# Altium schematic sheet 最小系统原理图.SchDoc
size A4
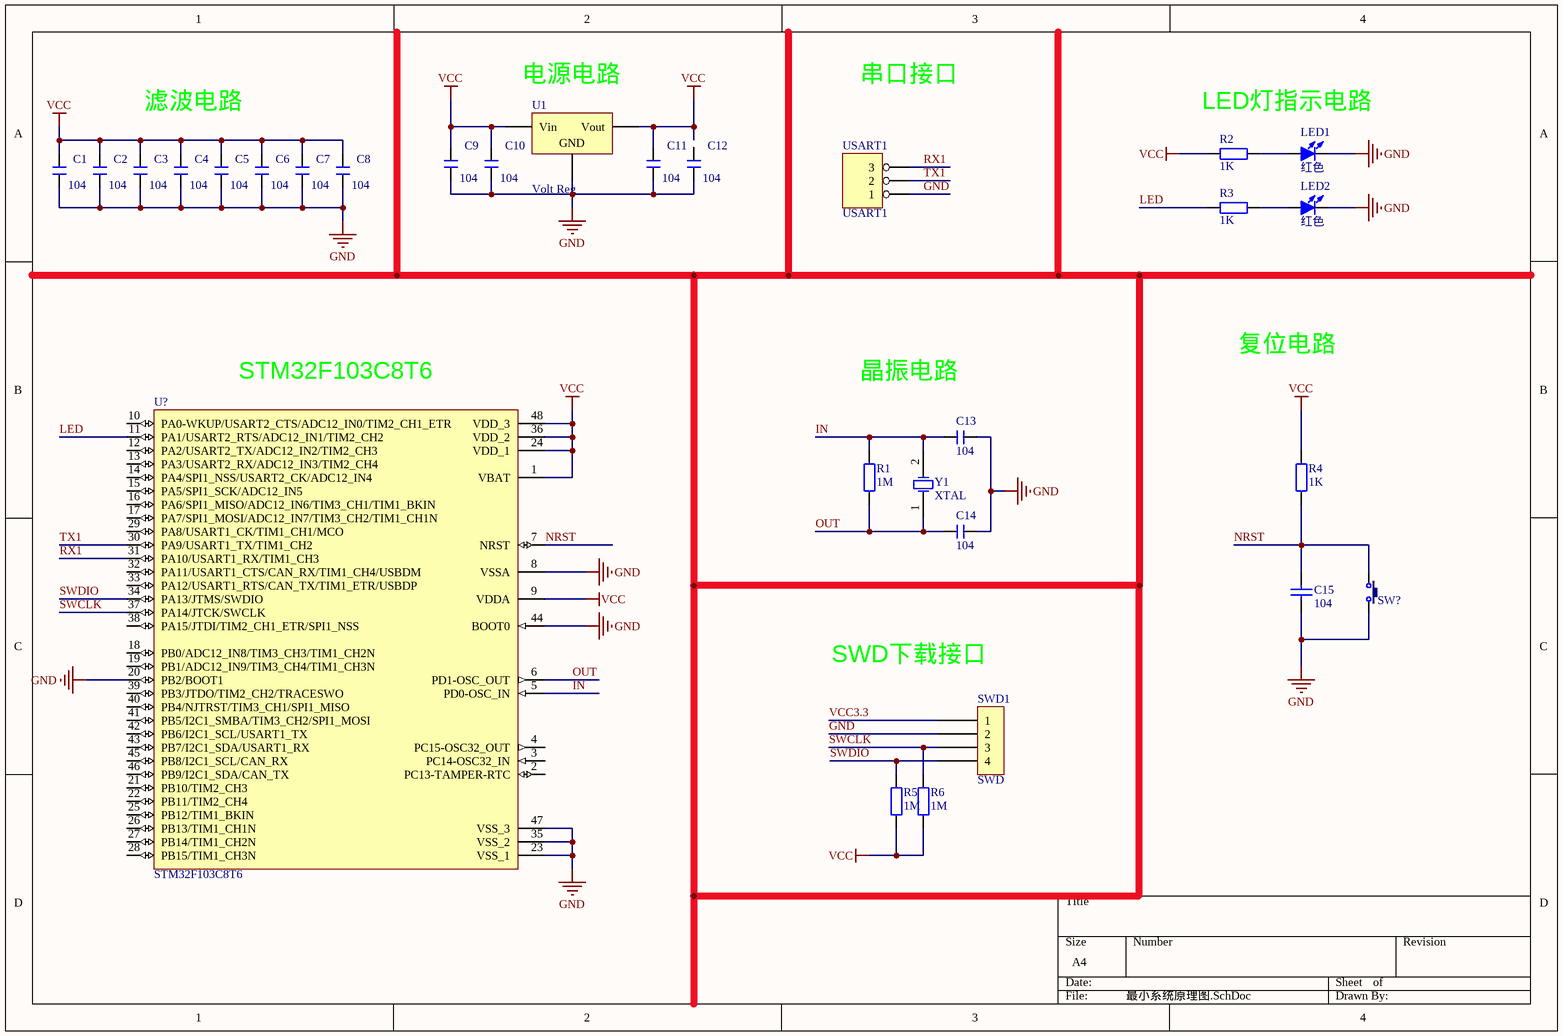
[diagram p0: 最小系统原理图.SchDoc]

## Parts
C1  104  [C 0805_L]
C2  104  [C 0805_L]
C3  104  [C 0805_L]
C4  104  [C 0805_L]
C5  104  [C 0805_L]
C6  104  [C 0805_L]
C7  104  [C 0805_L]
C8  104  [C 0805_L]
C9  104  [C 0805_L]
C10  104  [C 0805_L]
C11  104  [C 0805_L]
C12  104  [C 0805_L]
C13  104  [C 0805_L]
C14  104  [C 0805_L]
C15  104  [0805_c]
LED1  红色  [LED F234-W]
LED2  红色  [LED F234-W]
R1  1M  [RS 1/4W]
R2  1K  [RS 1/4W]
R3  1K  [RS 1/4W]
R4  1K  [RS 1/4W]
R5  1M  [RS 1/4W]
R6  1M  [RS 1/4W]
SW?  6x6x5  [TSW DIP-6*6*6_V]  (value not drawn)
SWD1  SWD
U1  Volt Reg  [D2PAK_N]
U?  STM32F103C8T6  [LQFP48_N]
USART1  USART1  [header3]
Y1  XTAL  [R38]

## Nets
GND: C1.1 C2.1 C3.1 C4.1 C5.1 C6.1 C7.1 C8.1 C9.1 C10.1 C11.1 C12.1 C13.1 C14.1 C15.1 LED1.2(K) LED2.2(K) SW?.2 SWD1.2 U1.2(GND) U?.8(VSSA) U?.20(PB2/BOOT1) U?.23(VSS_1) U?.35(VSS_2) U?.44(BOOT0) U?.47(VSS_3) USART1.1
VCC: C1.2 C2.2 C3.2 C4.2 C5.2 C6.2 C7.2 C8.2 C9.2 C10.2 C11.2 R2.1 R4.2 R5.1 R6.1 U1.1(Vin) U1.3(Vout) U?.1(VBAT) U?.9(VDDA) U?.24(VDD_1) U?.36(VDD_2) U?.48(VDD_3)
IN: C13.2 R1.2 U?.5(PD0-OSC_IN) Y1.2(OSC2)
LED: R3.1 U?.11(PA1/USART2_RTS/ADC12_IN1/TIM2_CH2)
NRST: C15.2 R4.1 SW?.1 U?.7(NRST)
OUT: C14.2 R1.1 U?.6(PD1-OSC_OUT) Y1.1(OSC1)
RX1: U?.31(PA10/USART1_RX/TIM1_CH3) USART1.3
SWCLK: R6.2 SWD1.3 U?.37(PA14/JTCK/SWCLK)
SWDIO: R5.2 SWD1.4 U?.34(PA13/JTMS/SWDIO)
TX1: U?.30(PA9/USART1_TX/TIM1_CH2) USART1.2
VCC3.3: SWD1.1
NetLED1_1: LED1.1(A) R2.2
NetLED2_1: LED2.1(A) R3.2

Not connected (* = marked no-connect by the designer): C12 2; U? 2(PC13-TAMPER-RTC) 3(PC14-OSC32_IN) 4(PC15-OSC32_OUT) 10(PA0-WKUP/USART2_CTS/ADC12_IN0/TIM2_CH1_ETR) 12(PA2/USART2_TX/ADC12_IN2/TIM2_CH3) 13(PA3/USART2_RX/ADC12_IN3/TIM2_CH4) 14(PA4/SPI1_NSS/USART2_CK/ADC12_IN4) 15(PA5/SPI1_SCK/ADC12_IN5) 16(PA6/SPI1_MISO/ADC12_IN6/TIM3_CH1/TIM1_BKIN) 17(PA7/SPI1_MOSI/ADC12_IN7/TIM3_CH2/TIM1_CH1N) 18(PB0/ADC12_IN8/TIM3_CH3/TIM1_CH2N) 19(PB1/ADC12_IN9/TIM3_CH4/TIM1_CH3N) 21(PB10/TIM2_CH3) 22(PB11/TIM2_CH4) 25(PB12/TIM1_BKIN) 26(PB13/TIM1_CH1N) 27(PB14/TIM1_CH2N) 28(PB15/TIM1_CH3N) 29(PA8/USART1_CK/TIM1_CH1/MCO) 32(PA11/USART1_CTS/CAN_RX/TIM1_CH4/USBDM) 33(PA12/USART1_RTS/CAN_TX/TIM1_ETR/USBDP) 38(PA15/JTDI/TIM2_CH1_ETR/SPI1_NSS) 39(PB3/JTDO/TIM2_CH2/TRACESWO) 40(PB4/NJTRST/TIM3_CH1/SPI1_MISO) 41(PB5/I2C1_SMBA/TIM3_CH2/SPI1_MOSI) 42(PB6/I2C1_SCL/USART1_TX) 43(PB7/I2C1_SDA/USART1_RX) 45(PB8/I2C1_SCL/CAN_RX) 46(PB9/I2C1_SDA/CAN_TX)

## Notes on the sheet
- (near U1) 电源电路
- 串口接口
- 滤波电路
- LED灯指示电路
- 复位电路
- (near U?) STM32F103C8T6
- (near C13) 晶振电路
- (near SWD1) SWD下载接口

## Library data of the parts
C1-C14 = C: 无极性贴片电容; 版权归属: 源创客; BOM名称: 无极性贴片电容; 学习资源: www.ooocke.com
C15 = CAP: Capacitor; Published: 8-Jun-2000; LatestRevisionDate: 17-Jul-2002; LatestRevisionNote: Re-released for DXP Platform.; PackageReference: RAD-0.3; Publisher: Altium Limited; Value: 104
LED1 LED2 = LED-F234: 方形LED; 版权归属: 源创客; BOM名称: 方形LED; 学习资源: www.ooocke.com
R1-R6 = R-CRR: 直插色环电阻; BOM名称: 色环电阻; 版权归属: 源创客; 学习资源: www.ooocke.com
SW? = TSW DIP-6x6_V: 侧按直插6x6轻触开关; 版权归属: 源创客; BOM名称: 直插6x6轻触开关; 学习资源: www.ooocke.com
SWD1 = Component_1
U1 = Volt Reg: Voltage Regulator; Published: 24-Mar-1999; LatestRevisionDate: 29-May-2009; LatestRevisionNote: IPC-7351 Footprint Added.; PackageReference: D2PAK; Publisher: Altium Limited; PackageDescription: 3-Pin Transistor Outline Package 2.54 mm Pitch, 15.1 mm Lead Span
U? = STM32F103C: Low-density performance line, ARM-based 32-bit MCU with 16 or  32 KB Flash, USB, CAN, 6 timers, 2 ADCs, 6 com. interfaces
USART1 = HEADER 3
Y1 = XTAL: Crystal Oscillator; Published: 8-Jun-2000; LatestRevisionDate: 17-Jul-2002; LatestRevisionNote: Re-released for DXP Platform.; PackageReference: R38; Publisher: Altium Limited; PackageDescription: Crystal, Thru-Hole; 2 Leads; Body 3.1 x 8.2 mm (Dia.xH)